# Altium schematic sheet wb_mux6.SchDoc
size A4
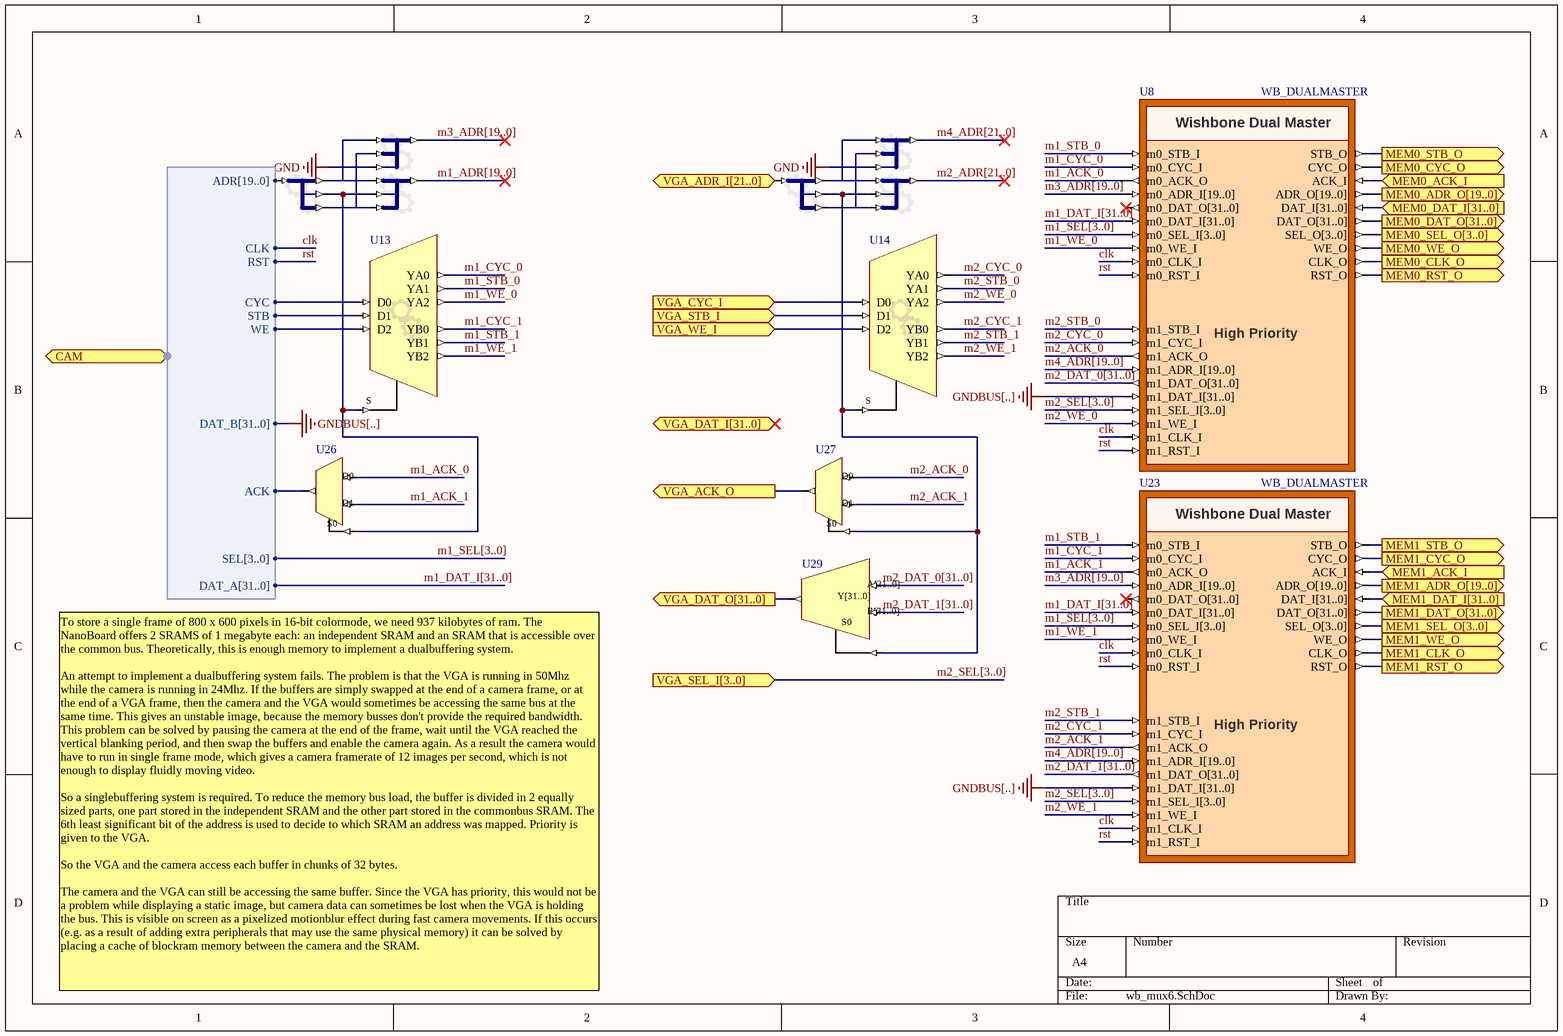
[diagram p0: wb_mux6.SchDoc]

## Parts
U8  WB_DUALMASTER
U9  BUS_JS  (value not drawn)
U10  BUS_JS  (value not drawn)
U11  BUS_JS  (value not drawn)
U12  BUS_JS  (value not drawn)
U13  DEMUX  (value not drawn)
U14  DEMUX  (value not drawn)
U23  WB_DUALMASTER
U26  M1_S2S1  (value not drawn)
U27  M1_S2S1  (value not drawn)
U29  M32_B2B1  (value not drawn)
U37  BUS_JS  (value not drawn)
U38  BUS_JS  (value not drawn)

## Ports
CAM (harness H_WB), MEM0_ACK_I (in), MEM0_ADR_O[19..0] (out), MEM0_CLK_O (out), MEM0_CYC_O (out), MEM0_DAT_I[31..0] (in), MEM0_DAT_O[31..0] (out), MEM0_RST_O (out), MEM0_SEL_O[3..0] (out), MEM0_STB_O (out), MEM0_WE_O (out), MEM1_ACK_I (in), MEM1_ADR_O[19..0] (out), MEM1_CLK_O (out), MEM1_CYC_O (out), MEM1_DAT_I[31..0] (in), MEM1_DAT_O[31..0] (out), MEM1_RST_O (out), MEM1_SEL_O[3..0] (out), MEM1_STB_O (out), MEM1_WE_O (out), VGA_ACK_O (out), VGA_ADR_I[21..0] (in), VGA_CYC_I (in), VGA_DAT_I[31..0] (in), VGA_DAT_O[31..0] (out), VGA_SEL_I[3..0] (in), VGA_STB_I (in), VGA_WE_I (in)

## Harnesses
H_WB: STB, CYC, ACK, ADR[19..0], DAT_A[31..0], CLK, RST, WE, SEL[3..0], DAT_B[31..0]

## Nets
GND: U12.I2 U37.I2
GNDBUS[..]: U8.m1_DAT_I[31..0] U23.m1_DAT_I[31..0] ; port CAM.DAT_B[31..0]
clk: U8.m0_CLK_I U8.m1_CLK_I U23.m0_CLK_I U23.m1_CLK_I ; port CAM.CLK
m1_ACK_0: U8.m0_ACK_O U26.D0
m1_ACK_1: U23.m0_ACK_O U26.D1
m1_ADR[19..0]: U10.O[19..0]
m1_CYC_0: U8.m0_CYC_I U13.YA0
m1_CYC_1: U13.YB0 U23.m0_CYC_I
m1_DAT_I[31..0]: U8.m0_DAT_I[31..0] U23.m0_DAT_I[31..0] ; port CAM.DAT_A[31..0]
m1_SEL[3..0]: U8.m0_SEL_I[3..0] U23.m0_SEL_I[3..0] ; port CAM.SEL[3..0]
m1_STB_0: U8.m0_STB_I U13.YA1
m1_STB_1: U13.YB1 U23.m0_STB_I
m1_WE_0: U8.m0_WE_I U13.YA2
m1_WE_1: U13.YB2 U23.m0_WE_I
m2_ACK_0: U8.m1_ACK_O U27.D0
m2_ACK_1: U23.m1_ACK_O U27.D1
m2_ADR[21..0]: U38.O[21..0]
m2_CYC_0: U8.m1_CYC_I U14.YA0
m2_CYC_1: U14.YB0 U23.m1_CYC_I
m2_DAT_0[31..0]: U8.m1_DAT_O[31..0] U29.A[31..0]
m2_DAT_1[31..0]: U23.m1_DAT_O[31..0] U29.B[31..0]
m2_SEL[3..0]: U8.m1_SEL_I[3..0] U23.m1_SEL_I[3..0] ; port VGA_SEL_I[3..0]
m2_STB_0: U8.m1_STB_I U14.YA1
m2_STB_1: U14.YB1 U23.m1_STB_I
m2_WE_0: U8.m1_WE_I U14.YA2
m2_WE_1: U14.YB2 U23.m1_WE_I
m3_ADR[19..0]: U8.m0_ADR_I[19..0] U12.O[19..0] U23.m0_ADR_I[19..0]
m4_ADR[19..0]: U8.m1_ADR_I[19..0] U23.m1_ADR_I[19..0]
m4_ADR[21..0]: U37.O[21..0]
MEM0_ACK_I: U8.ACK_I ; port MEM0_ACK_I
MEM0_ADR_O[19..0]: U8.ADR_O[19..0] ; port MEM0_ADR_O[19..0]
MEM0_CLK_O: U8.CLK_O ; port MEM0_CLK_O
MEM0_CYC_O: U8.CYC_O ; port MEM0_CYC_O
MEM0_DAT_I[31..0]: U8.DAT_I[31..0] ; port MEM0_DAT_I[31..0]
MEM0_DAT_O[31..0]: U8.DAT_O[31..0] ; port MEM0_DAT_O[31..0]
MEM0_RST_O: U8.RST_O ; port MEM0_RST_O
MEM0_SEL_O[3..0]: U8.SEL_O[3..0] ; port MEM0_SEL_O[3..0]
MEM0_STB_O: U8.STB_O ; port MEM0_STB_O
MEM0_WE_O: U8.WE_O ; port MEM0_WE_O
MEM1_ACK_I: U23.ACK_I ; port MEM1_ACK_I
MEM1_ADR_O[19..0]: U23.ADR_O[19..0] ; port MEM1_ADR_O[19..0]
MEM1_CLK_O: U23.CLK_O ; port MEM1_CLK_O
MEM1_CYC_O: U23.CYC_O ; port MEM1_CYC_O
MEM1_DAT_I[31..0]: U23.DAT_I[31..0] ; port MEM1_DAT_I[31..0]
MEM1_DAT_O[31..0]: U23.DAT_O[31..0] ; port MEM1_DAT_O[31..0]
MEM1_RST_O: U23.RST_O ; port MEM1_RST_O
MEM1_SEL_O[3..0]: U23.SEL_O[3..0] ; port MEM1_SEL_O[3..0]
MEM1_STB_O: U23.STB_O ; port MEM1_STB_O
MEM1_WE_O: U23.WE_O ; port MEM1_WE_O
rst: U8.m0_RST_I U8.m1_RST_I U23.m0_RST_I U23.m1_RST_I ; port CAM.RST
VGA_ACK_O: U27.O ; port VGA_ACK_O
VGA_ADR_I[21..0]: U11.I[21..0] ; port VGA_ADR_I[21..0]
VGA_CYC_I: U14.D0 ; port VGA_CYC_I
VGA_DAT_O[31..0]: U29.Y[31..0] ; port VGA_DAT_O[31..0]
VGA_STB_I: U14.D1 ; port VGA_STB_I
VGA_WE_I: U14.D2 ; port VGA_WE_I
NetU9_I[19..0]: U9.I[19..0] ; port CAM.ADR[19..0]
NetU9_O0_B[4..0]: U9.O0_B[4..0] U10.I0_B[4..0] U12.I0_B[4..0]
NetU9_O1: U9.O1 U10.I1 U13.S U26.S0
NetU9_O2_B[13..0]: U9.O2_B[13..0] U10.I2_B[13..0] U12.I1_B[13..0]
NetU11_O0_B[4..0]: U11.O0_B[4..0] U37.I0_B[4..0] U38.I0_B[4..0]
NetU11_O1: U11.O1 U14.S U27.S0 U29.S0 U38.I1
NetU11_O2_B[15..0]: U11.O2_B[15..0] U37.I1_B[15..0] U38.I2_B[15..0]
NetU13_D0: U13.D0 ; port CAM.CYC
NetU13_D1: U13.D1 ; port CAM.STB
NetU13_D2: U13.D2 ; port CAM.WE
NetU26_O: U26.O ; port CAM.ACK

Not connected (* = marked no-connect by the designer): U8 m0_DAT_O[31..0]*; U23 m0_DAT_O[31..0]*

## Buses and harness runs
bus m1_ADR[19..0]
bus m1_DAT_I[31..0]
bus m1_SEL[3..0]
bus m2_ADR[21..0]
bus m2_DAT_0[31..0]
bus m2_DAT_1[31..0]
bus m2_SEL[3..0]
bus m2_SEL[3..0] = port VGA_SEL_I[3..0]
bus m3_ADR[19..0]
bus m4_ADR[19..0]
bus m4_ADR[21..0]

## Notes on the sheet
- To store a single frame of 800 x 600 pixels in 16-bit colormode, we need 937 kilobytes of ram. The NanoBoard offers 2 SRAMS of 1 megabyte each: an independent SRAM and an SRAM that is accessible over the common bus. Theoretically, this is enough memory to implement a dualbuffering system.
  An attempt to implement a dualbuffering system fails. The problem is that the VGA is running in 50Mhz while the camera is running in 24Mhz. If the buffers are simply swapped at the end of a camera frame, or at the end of a VGA frame, then the camera and the VGA would sometimes be accessing the same bus at the same time. This gives an unstable image, because the memory busses don't provide the required bandwidth. This problem can be solved by pausing the camera at the end of the frame, wait until the VGA reached the vertical blanking period, and then swap the buffers and enable the camera again. As a result the camera would have to run in single frame mode, which gives a camera framerate of 12 images per second, which is not enough to display fluidly moving video.
  So a singlebuffering system is required. To reduce the memory bus load, the buffer is divided in 2 equally sized parts, one part stored in the independent SRAM and the other part stored in the commonbus SRAM. The 6th least significant bit of the address is used to decide to which SRAM an address was mapped. Priority is given to the VGA.
  So the VGA and the camera access each buffer in chunks of 32 bytes.
  The camera and the VGA can still be accessing the same buffer. Since the VGA has priority, this would not be a problem while displaying a static image, but camera data can sometimes be lost when the VGA is holding the bus. This is visible on screen as a pixelized motionblur effect during fast camera movements. If this occurs (e.g. as a result of adding extra peripherals that may use the same physical memory) it can be solved by placing a cache of blockram memory between the camera and the SRAM.
- (in symbol WB_DUALMASTER) Wishbone Dual Master; High Priority

## Library data of the parts
U8 U23 = WB_DUALMASTER: Configurable Wishbone Dual Master; ConfigurationParameters: {}Version[1.0]{}DataWidth[0]{}AddressWidth[20]{}SpaceAfter[4]{}DualType[1]{}PriorityDevice[1]; ComponentLink1Description: Core &Resource Usage; ComponentLink1URL: CR0139 FPGA Peripheral Resource Usage.pdf#page=70; HelpURL: https://wiki.altium.com/display/ADOH/WB_DUALMASTER+-+Configurable+Wishbone+Dual+Master; LastRevisionNo: 1.00.00; Published: 9-Dec-2004; Publisher: Altium Limited; ConfiguratorName: WB_DUALMASTER
U9 = BUS_JS: Configurable Bus Joiner/Splitter; ConfiguratorName: GENERIC_BUS_JS; ConfigurationParameters: {}Version[1.1]{}SplitterJoinerType[Splitter]{}SignalCount[3]{}SignalWidth0[5]{}GapBelow0[1000000]{}ConnectionType0[Pin]{}SignalWidth1[1]{}GapBelow1[1000000]{}ConnectionType1[Pin]{}SignalWidth2[14]{}GapBelow2[1000000]{}ConnectionType2[Pin]{}ShowPinNames[False]{}; LastRevisionNo: 1.00.00; Published: 17-Sep-2008; Publisher: Altium Limited; HelpURL: https://wiki.altium.com/display/ADOH/Configurable+Generic+Library
U10 = BUS_JS: Configurable Bus Joiner/Splitter; ConfiguratorName: GENERIC_BUS_JS; ConfigurationParameters: {}Version[1.1]{}SplitterJoinerType[Joiner]{}SignalCount[3]{}SignalWidth0[5]{}GapBelow0[1000000]{}ConnectionType0[Pin]{}SignalWidth1[1]{}GapBelow1[1000000]{}ConnectionType1[Pin]{}SignalWidth2[14]{}GapBelow2[1000000]{}ConnectionType2[Pin]{}ShowPinNames[False]{}; LastRevisionNo: 1.00.00; Published: 17-Sep-2008; Publisher: Altium Limited; HelpURL: https://wiki.altium.com/display/ADOH/Configurable+Generic+Library
U11 = BUS_JS: Configurable Bus Joiner/Splitter; ConfiguratorName: GENERIC_BUS_JS; ConfigurationParameters: {}Version[1.1]{}SplitterJoinerType[Splitter]{}SignalCount[3]{}SignalWidth0[5]{}GapBelow0[1000000]{}ConnectionType0[Pin]{}SignalWidth1[1]{}GapBelow1[1000000]{}ConnectionType1[Pin]{}SignalWidth2[16]{}GapBelow2[1000000]{}ConnectionType2[Pin]{}ShowPinNames[False]{}; LastRevisionNo: 1.00.00; Published: 17-Sep-2008; Publisher: Altium Limited; HelpURL: https://wiki.altium.com/display/ADOH/Configurable+Generic+Library
U12 = BUS_JS: Configurable Bus Joiner/Splitter; ConfiguratorName: GENERIC_BUS_JS; ConfigurationParameters: {}Version[1.1]{}SplitterJoinerType[Joiner]{}SignalCount[3]{}SignalWidth0[5]{}GapBelow0[1000000]{}ConnectionType0[Pin]{}SignalWidth1[14]{}GapBelow1[1000000]{}ConnectionType1[Pin]{}SignalWidth2[1]{}GapBelow2[1000000]{}ConnectionType2[Pin]{}ShowPinNames[False]{}; LastRevisionNo: 1.00.00; Published: 17-Sep-2008; Publisher: Altium Limited; HelpURL: https://wiki.altium.com/display/ADOH/Configurable+Generic+Library
U13 U14 = DEMUX: Configurable Demutliplexer; ConfigurationParameters: {}Version[1.0]{}ShowEnable[False]{}BusInputs[False]{}BusOutputs[False]{}SignalWidth[3]{}Type[Demultiplexer]{}RegisterOutputs[False]{}NegativeClockEdge[False]{}ShowPinNames[True]{}InvertSingleSignal[False]{}SignalCount[2]{}Invert0[False]{}Invert1[False]{}; ConfiguratorName: GENERIC_MULTIPLEXER; LastRevisionNo: 1.00.00; Published: 31-Dec-2008; Publisher: Altium Limited
U26 U27 = M1_S2S1: 2x1-Single Wire to 1x1-Single Wire Multiplexer; XilinxEquivalent: M2_1; SubClass: SnS1; PortSize: 1; PortStyle: Single Pin Version; ArchiveName: GENERIC; VHDLIB_SIM: GENERIC_LIB; Published: 29-Jan-2004; Publisher: Altium Limited; LastRevisionNo: 1.00.00; HelpURL: CR0118 FPGA Generic Library Guide.pdf#page=364; ComponentLink1URL: CR0137 FPGA Multiplexer Resource Usage.pdf#page=50; ComponentLink1Description: Core &Resource Usage; FunctionalClass: Multiplexer
U29 = M32_B2B1: 2x32-Bit Bus to 1x32-Bit Bus Multiplexer; SubClass: BnB1; PortSize: 32; PortStyle: Bus Version; ArchiveName: GENERIC; VHDLIB_SIM: GENERIC_LIB; Published: 29-Jan-2004; Publisher: Altium Limited; LastRevisionNo: 1.00.00; HelpURL: CR0118 FPGA Generic Library Guide.pdf#page=364; ComponentLink1URL: CR0137 FPGA Multiplexer Resource Usage.pdf#page=446; ComponentLink1Description: Core &Resource Usage; FunctionalClass: Multiplexer
U37 = BUS_JS: Configurable Bus Joiner/Splitter; ConfiguratorName: GENERIC_BUS_JS; ConfigurationParameters: {}Version[1.1]{}SplitterJoinerType[Joiner]{}SignalCount[3]{}SignalWidth0[5]{}GapBelow0[1000000]{}ConnectionType0[Pin]{}SignalWidth1[16]{}GapBelow1[1000000]{}ConnectionType1[Pin]{}SignalWidth2[1]{}GapBelow2[1000000]{}ConnectionType2[Pin]{}ShowPinNames[False]{}; LastRevisionNo: 1.00.00; Published: 17-Sep-2008; Publisher: Altium Limited; HelpURL: https://wiki.altium.com/display/ADOH/Configurable+Generic+Library
U38 = BUS_JS: Configurable Bus Joiner/Splitter; ConfiguratorName: GENERIC_BUS_JS; ConfigurationParameters: {}Version[1.1]{}SplitterJoinerType[Joiner]{}SignalCount[3]{}SignalWidth0[5]{}GapBelow0[1000000]{}ConnectionType0[Pin]{}SignalWidth1[1]{}GapBelow1[1000000]{}ConnectionType1[Pin]{}SignalWidth2[16]{}GapBelow2[1000000]{}ConnectionType2[Pin]{}ShowPinNames[False]{}; LastRevisionNo: 1.00.00; Published: 17-Sep-2008; Publisher: Altium Limited; HelpURL: https://wiki.altium.com/display/ADOH/Configurable+Generic+Library